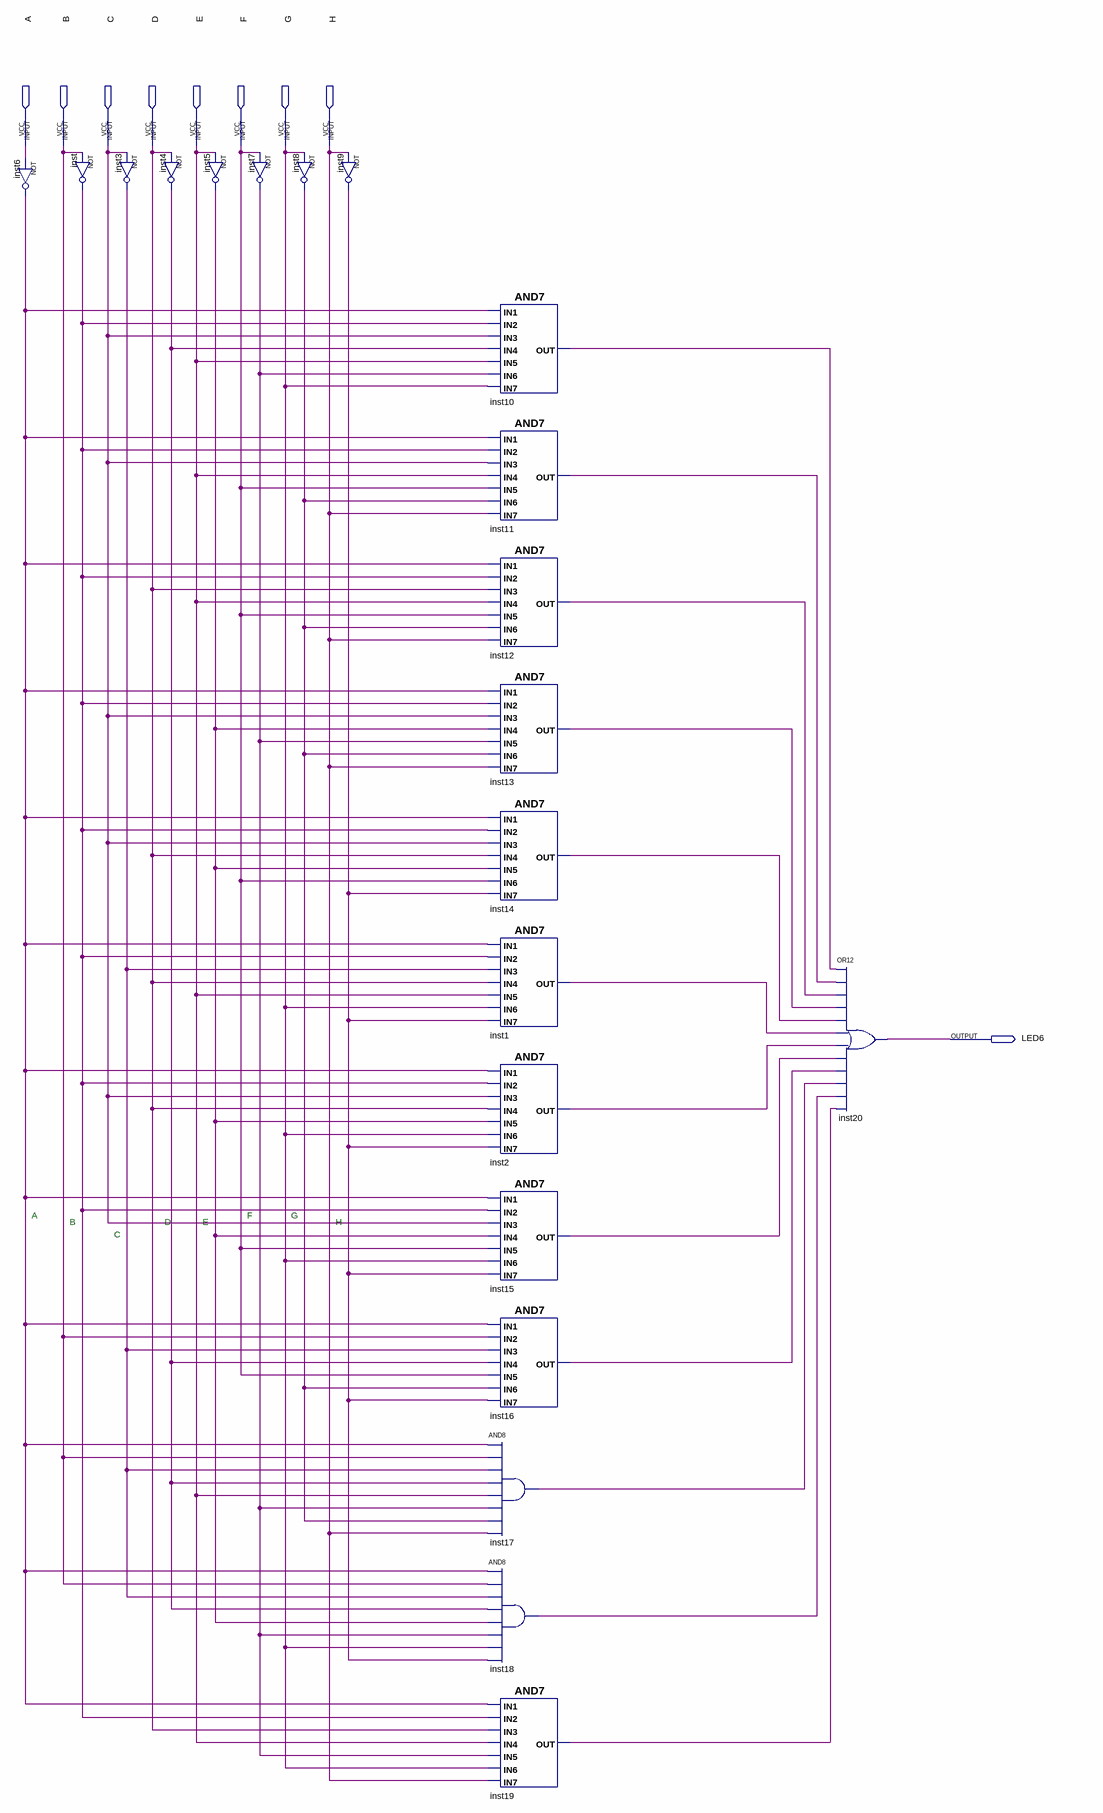
[diagram p0: schematic sheet]
// Quartus schematic LED6.bdf as structural Verilog: 21 symbols, 9 pins
module LED6 (
  input  A,
  input  B,
  input  C,
  input  D,
  input  E,
  input  F,
  input  G,
  input  H,
  output LED6
);

  wire inst1_out, inst2_out, inst3_out, inst4_out, inst5_out, inst6_out, inst7_out, inst8_out, inst9_out,
       inst10_out, inst11_out, inst12_out, inst13_out, inst14_out, inst15_out, inst16_out, inst17_out,
       inst18_out, inst19_out, inst_out;

  not inst6 (inst6_out, A);
  not inst (inst_out, B);
  not inst3 (inst3_out, C);
  not inst4 (inst4_out, D);
  not inst5 (inst5_out, E);
  not inst7 (inst7_out, F);
  not inst8 (inst8_out, G);
  not inst9 (inst9_out, H);
  and inst10 (inst10_out, inst6_out, inst_out, C, inst4_out, E, inst7_out, G);
  and inst11 (inst11_out, inst6_out, inst_out, C, E, F, inst8_out, H);
  and inst12 (inst12_out, inst6_out, inst_out, D, E, F, inst8_out, H);
  and inst13 (inst13_out, inst6_out, inst_out, C, inst5_out, inst7_out, inst8_out, H);
  and inst14 (inst14_out, inst6_out, inst_out, C, D, inst5_out, F, inst9_out);
  and inst1 (inst1_out, inst6_out, inst_out, inst3_out, D, E, G, inst9_out);
  and inst2 (inst2_out, inst6_out, inst_out, C, D, inst5_out, G, inst9_out);
  and inst15 (inst15_out, inst6_out, inst_out, C, inst5_out, F, G, inst9_out);
  and inst16 (inst16_out, inst6_out, B, inst3_out, inst4_out, F, inst8_out, inst9_out);
  and inst17 (inst17_out, inst6_out, B, inst3_out, inst4_out, E, inst7_out, inst8_out, H);
  and inst18 (inst18_out, inst6_out, B, inst3_out, inst4_out, inst5_out, inst7_out, G, inst9_out);
  and inst19 (inst19_out, inst6_out, inst_out, D, E, inst7_out, G, H);
  or inst20 (LED6, inst10_out, inst11_out, inst12_out, inst13_out, inst14_out, inst1_out, inst2_out, inst15_out, inst16_out, inst17_out, inst18_out, inst19_out);

  // Notes on the sheet:
  //   A
  //   F
  //   G
  //   B
  //   D
  //   E
  //   H
  //   C
endmodule
